# Altium schematic sheet P00160.5.28_P.SchDoc
size A2
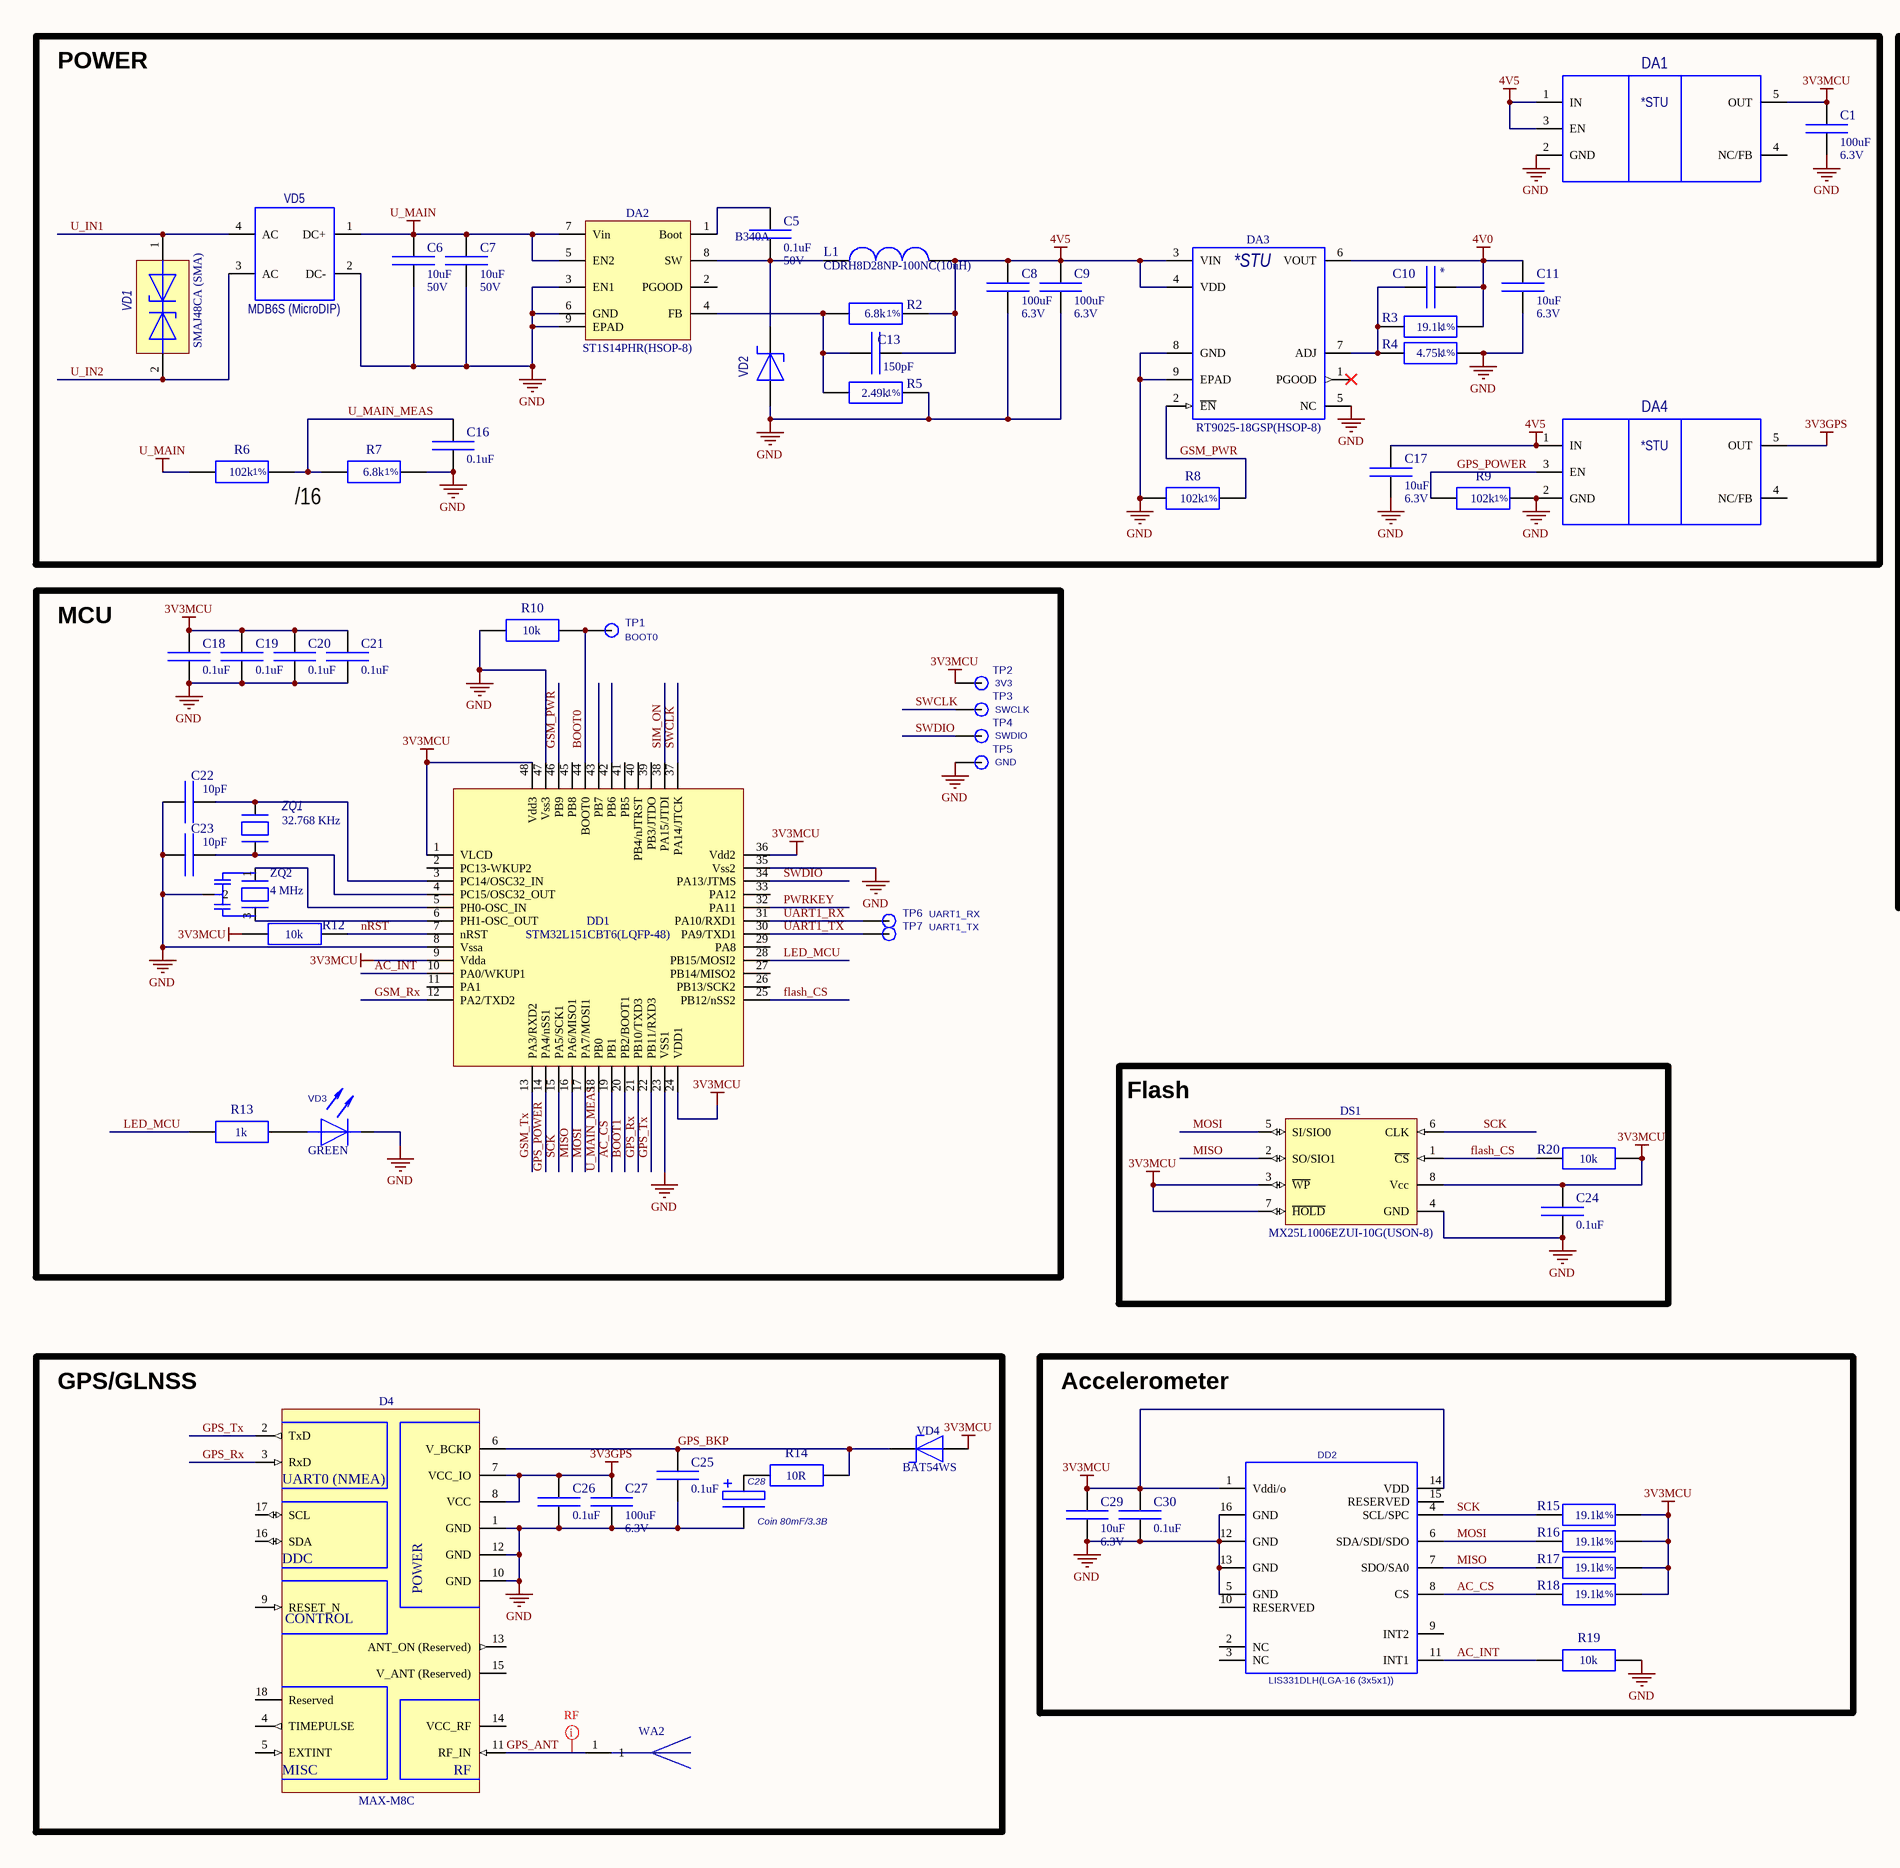
[diagram p0: P00160.5.28_P.SchDoc, left]
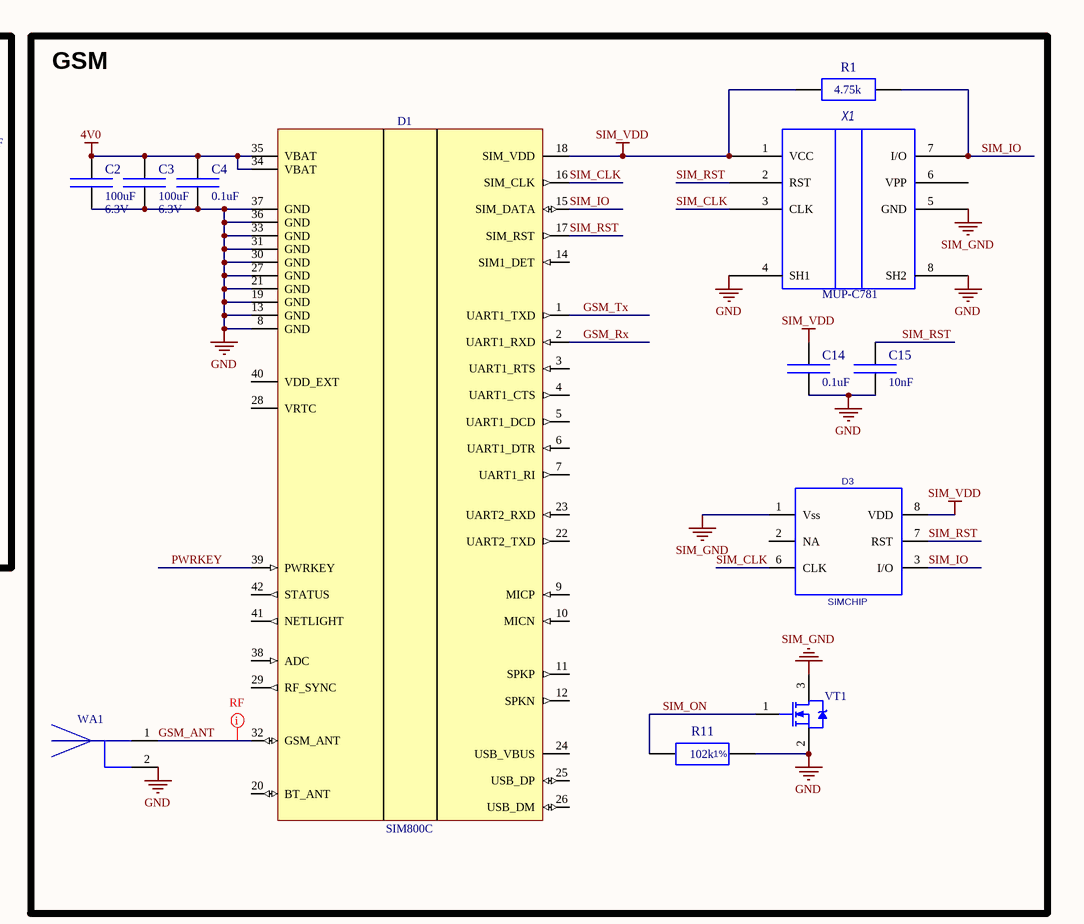
[diagram p1: P00160.5.28_P.SchDoc, right]

## Parts
C1  value 100uF  parVoltage: 6.3V  [CAPC3216X135(1206)]  (hidden comment: чип 1206 100uF/6.3V,)
C2  value 100uF  parVoltage: 6.3V  [CAPC3216X135(1206)]  (hidden comment: чип 1206 100uF/6.3V,)
C3  value 100uF  parVoltage: 6.3V  [CAPC3216X135(1206)]  (hidden comment: чип 1206 100uF/6.3V,)
C4  value 0.1uF  [CAPC1005X50(0402)]  (hidden comment: чип 0402 0.1uF/10V,)
C5  value 0.1uF  parVoltage: 50V  [CAPC1608X50(0603)]  (hidden comment: чип 0603 0.1uF/50V,)
C6  value 10uF  parVoltage: 50V  [CAPC3216X135(1206)]  (hidden comment: чип 1206 10uF/50V,)
C7  value 10uF  parVoltage: 50V  [CAPC3216X135(1206)]  (hidden comment: чип 1206 10uF/50V,)
C8  value 100uF  parVoltage: 6.3V  [CAPC3216X135(1206)]  (hidden comment: чип 1206 100uF/6.3V,)
C9  value 100uF  parVoltage: 6.3V  [CAPC3216X135(1206)]  (hidden comment: чип 1206 100uF/6.3V,)
C10  чип 0402 */,  [CAPC1005X50(0402)]  (value not drawn)
C11  value 10uF  parVoltage: 6.3V  [CAPC1608X50(0603)]  (hidden comment: чип 0603 10uF/6.3V,)
C13  value 150pF  [CAPC1005X50(0402)]  (hidden comment: чип 0402 150pF/50V,)
C14  value 0.1uF  [CAPC1005X50(0402)]  (hidden comment: чип 0402 0.1uF/10V,)
C15  value 10nF  [CAPC1005X50(0402)]  (hidden comment: чип 0402 10nF/10V,)
C16  value 0.1uF  [CAPC1005X50(0402)]  (hidden comment: чип 0402 0.1uF/10V,)
C17  value 10uF  parVoltage: 6.3V  [CAPC1608X50(0603)]  (hidden comment: чип 0603 10uF/6.3V,)
C18  value 0.1uF  [CAPC1005X50(0402)]  (hidden comment: чип 0402 0.1uF/10V,)
C19  value 0.1uF  [CAPC1005X50(0402)]  (hidden comment: чип 0402 0.1uF/10V,)
C20  value 0.1uF  [CAPC1005X50(0402)]  (hidden comment: чип 0402 0.1uF/10V,)
C21  value 0.1uF  [CAPC1005X50(0402)]  (hidden comment: чип 0402 0.1uF/10V,)
C22  value 10pF  [CAPC1005X50(0402)]  (hidden comment: чип 0402 10pF/10V,)
C23  value 10pF  [CAPC1005X50(0402)]  (hidden comment: чип 0402 10pF/10V,)
C24  value 0.1uF  [CAPC1005X50(0402)]  (hidden comment: чип 0402 0.1uF/10V,)
C25  value 0.1uF  [CAPC1005X50(0402)]  (hidden comment: чип 0402 0.1uF/10V,)
C26  value 0.1uF  [CAPC1005X50(0402)]  (hidden comment: чип 0402 0.1uF/10V,)
C27  value 100uF  parVoltage: 6.3V  [CAPC3216X135(1206)]  (hidden comment: чип 1206 100uF/6.3V,)
C28  Coin 80mF/3.3В  [XH414HG-IV01E]
C29  value 10uF  parVoltage: 6.3V  [CAPC1608X50(0603)]  (hidden comment: чип 0603 10uF/6.3V,)
C30  value 0.1uF  [CAPC1005X50(0402)]  (hidden comment: чип 0402 0.1uF/10V,)
D1  SIM800C  [SIMCOM800C]
D3  SIMCHIP  [VQFN127P600-8N]
D4  MAX-M8C  [MAX-7]
DA1  TPS76333DBV(SOT23-5)  [SOT95P285X130-5N(SOT23-5)]  (value not drawn)
DA2  ST1S14PHR(HSOP-8)  [HSOP127P-8N]
DA3  RT9025-18GSP(HSOP-8)  [HSOP127P-8N]
DA4  TPS76333DBV(SOT23-5)  [SOT95P285X130-5N(SOT23-5)]  (value not drawn)
DD1  STM32L151CBT6(LQFP-48)  [TSQFP50P900X900X160-48N]
DD2  LIS331DLH(LGA-16 (3x5x1))  [LGA16S50P3X5_300X300X100]
DS1  MX25L1006EZUI-10G(USON-8)  [SON50P300X60_HS-9N]
L1  CDRH8D28NP-100NC(10uH)  [CDRH8D28NP]
R1  value 4.75k  [RESC1005X35(0402)]  (hidden comment: чип 0402 4.75k 1%)
R2  value 6.8k  Tolerance: 1%  [RESC1005X35(0402)]  (hidden comment: чип 0402 6.8k 1%)
R3  value 19.1k  Tolerance: 1%  [RESC1005X35(0402)]  (hidden comment: чип 0402 19.1k 1%)
R4  value 4.75k  Tolerance: 1%  [RESC1005X35(0402)]  (hidden comment: чип 0402 4.75k 1%)
R5  value 2.49k  Tolerance: 1%  [RESC1005X35(0402)]  (hidden comment: чип 0402 2.49k 1%)
R6  value 102k  Tolerance: 1%  [RESC1005X35(0402)]  (hidden comment: чип 0402 102k 1%)
R7  value 6.8k  Tolerance: 1%  [RESC1005X35(0402)]  (hidden comment: чип 0402 6.8k 1%)
R8  value 102k  Tolerance: 1%  [RESC1005X35(0402)]  (hidden comment: чип 0402 102k 1%)
R9  value 102k  Tolerance: 1%  [RESC1005X35(0402)]  (hidden comment: чип 0402 102k 1%)
R10  value 10k  [RESC1005X35(0402)]  (hidden comment: чип 0402 10k 5%)
R11  value 102k  Tolerance: 1%  [RESC1005X35(0402)]  (hidden comment: чип 0402 102k 1%)
R12  value 10k  [RESC1005X35(0402)]  (hidden comment: чип 0402 10k 5%)
R13  value 1k  [RESC1005X35(0402)]  (hidden comment: чип 0402 1k 5%)
R14  value 10R  [RESC1005X35(0402)]  (hidden comment: чип 0402 10R 5%)
R15  value 19.1k  Tolerance: 1%  [RESC1005X35(0402)]  (hidden comment: чип 0402 19.1k 1%)
R16  value 19.1k  Tolerance: 1%  [RESC1005X35(0402)]  (hidden comment: чип 0402 19.1k 1%)
R17  value 19.1k  Tolerance: 1%  [RESC1005X35(0402)]  (hidden comment: чип 0402 19.1k 1%)
R18  value 19.1k  Tolerance: 1%  [RESC1005X35(0402)]  (hidden comment: чип 0402 19.1k 1%)
R19  value 10k  [RESC1005X35(0402)]  (hidden comment: чип 0402 10k 5%)
R20  value 10k  [RESC1005X35(0402)]  (hidden comment: чип 0402 10k 5%)
TP1  BOOT0  [TEST_POINT]  (no BOM)
TP2  3V3  [TEST_POINT]  (no BOM)
TP3  SWCLK  [TEST_POINT]  (no BOM)
TP4  SWDIO  [TEST_POINT]  (no BOM)
TP5  GND  [TEST_POINT]  (no BOM)
TP6  UART1_RX  [TEST_POINT]  (no BOM)
TP7  UART1_TX  [TEST_POINT]  (no BOM)
VD1  SMAJ48CA (SMA)  [DIOM5226X267N (SMA) B]
VD2  cmpPartNum: B340A  [DIOM5226X267N (SMA)]  (hidden comment: B340A (SMA))
VD3  parColor: GREEN  [LED1005X50N(0402)_GREEN]  (hidden comment: APHHS1005SURCK (чип 0402))
VD4  BAT54WS (SOD323)  [SOD2514X110N(SOD323)]  (value not drawn)
VD5  MDB6S (MicroDIP)  [Micro-DIP]
VT1  IRLML0030TRPBF (SOT-23)  [SOT95P230-3N (SOT-23) num]  (value not drawn)
WA1  (no value)  [PCB_ANT]
WA2  UDA182-180-1575-C-GPS-GLONASS-PCB  [UDA182]  (value not drawn)
X1  MUP Connectors MUP-C781  [MUP-C781]  (value not drawn)
ZQ1  value 32.768 KHz  [XTAL320X150X90-2N(DST)]  (hidden comment: DST310S(32.768 KHz))
ZQ2  value 4 MHz  [XTAL450X200X120 (CSTCR)]  (hidden comment: CSTCR4M00G15C99-R0(4 MHz))

## Blocks framed on the sheet
GSM: C2-C4 C14 C15 D1 D3 R1 R11 VT1 WA1 X1
MCU: C18-C23 DD1 R10 R12 R13 TP1-TP7 VD3 ZQ1 ZQ2
Flash: C24 DS1 R20
GPS/GLNSS: C25-C28 D4 R14 VD4 WA2
Accelerometer: C29 C30 DD2 R15-R19

## Nets
3V3GPS: C26.2(P2) C27.1 D4.7(VCC_IO) D4.8(VCC) DA4.5(OUT)
3V3MCU: C1.1 C18.2(P2) C19.2(P2) C20.2(P2) C21.2(P2) C24.2(P2) C29.2 C30.2(P2) DA1.5(OUT) DD1.1(VLCD) DD1.9(Vdda) DD1.24(VDD1) DD1.36(Vdd2) DD1.48(Vdd3) DD2.1(Vddi/o) DD2.14(VDD) DS1.3(~{WP}) DS1.7(~{HOLD}) DS1.8(Vcc) R12.1 R15.2 R16.2 R17.2 R18.2 R20.2 TP2.1 VD4.A
4V0: C2.1 C3.1 C4.2(P2) C10.1(P1) C11.2 D1.34(VBAT) D1.35(VBAT) DA3.6(VOUT) R3.2
4V5: C8.1 C9.1 C13.1(P1) C17.2 DA1.1(IN) DA1.3(EN) DA3.3(VIN) DA3.4(VDD) DA4.1(IN) L1.2 R2.2
GND: C1.2 C2.2 C3.2 C4.1(P1) C6.2 C7.2 C8.2 C9.2 C11.1 C14.1(P1) C15.1(P1) C16.1(P1) C17.1 C18.1(P1) C19.1(P1) C20.1(P1) C21.1(P1) C22.2(P2) C23.2(P2) C24.1(P1) C25.1(P1) C26.1(P1) C27.2 C28.2 C29.1 C30.1(P1) D1.8(GND) D1.13(GND) D1.19(GND) D1.21(GND) D1.27(GND) D1.30(GND) D1.31(GND) D1.33(GND) D1.36(GND) D1.37(GND) D4.1(GND) D4.10(GND) D4.12(GND) DA1.2(GND) DA2.3(EN1) DA2.6(GND) DA2.9(EPAD) DA3.5(NC) DA3.8(GND) DA3.9(EPAD) DA4.2(GND) DD1.8(Vssa) DD1.23(VSS1) DD1.35(Vss2) DD1.47(Vss3) DD2.5(GND) DD2.12(GND) DD2.13(GND) DD2.16(GND) DS1.4(GND) R4.2 R5.2 R7.2 R8.1 R9.2 R10.1 R11.2 R19.2 TP5.1 VD2.A VD3.C(cathode) VD5.2(DC-) VT1.2(S) WA1.2 X1.4(SH1) X1.8(SH2) ZQ2.2
SIM_GND: D3.1(Vss) VT1.3(D) X1.5(GND)
SIM_VDD: C14.2(P2) D1.18(SIM_VDD) D3.8(VDD) R1.1 X1.1(VCC)
U_MAIN: C6.1 C7.1 DA2.5(EN2) DA2.7(Vin) R6.1 VD5.1(DC+)
AC_CS: DD1.19(PB1) DD2.8(CS) R18.1
AC_INT: DD1.10(PA0/WKUP1) DD2.11(INT1) R19.1
BOOT0: DD1.44(BOOT0) R10.2 TP1.1
BOOT1: DD1.20(PB2/BOOT1)
flash_CS: DD1.25(PB12/nSS2) DS1.1(~{CS}) R20.1
GPS_ANT: D4.11(RF_IN) WA2.1
GPS_BKP: C25.2(P2) D4.6(V_BCKP) R14.2 VD4.C
GPS_POWER: DA4.3(EN) DD1.14(PA4/nSS1) R9.1
GPS_Rx: D4.3(RxD) DD1.21(PB10/TXD3)
GPS_Tx: D4.2(TxD) DD1.22(PB11/RXD3)
GSM_ANT: D1.32(GSM_ANT) WA1.1
GSM_PWR: DA3.2(~{EN}) DD1.46(PB9) R8.2
GSM_Rx: D1.2(UART1_RXD) DD1.12(PA2/TXD2)
GSM_Tx: D1.1(UART1_TXD) DD1.13(PA3/RXD2)
LED_MCU: DD1.28(PB15/MOSI2) R13.1
MISO: DD1.16(PA6/MISO1) DD2.7(SDO/SA0) DS1.2(SO/SIO1) R17.1
MOSI: DD1.17(PA7/MOSI1) DD2.6(SDA/SDI/SDO) DS1.5(SI/SIO0) R16.1
nRST: DD1.7(nRST) R12.2
PWRKEY: D1.39(PWRKEY) DD1.32(PA11)
SCK: DD1.15(PA5/SCK1) DD2.4(SCL/SPC) DS1.6(CLK) R15.1
SIM_CLK: D1.16(SIM_CLK) D3.6(CLK) X1.3(CLK)
SIM_IO: D1.15(SIM_DATA) D3.3(I/O) R1.2 X1.7(I/O)
SIM_ON: DD1.38(PA15/JTDI) R11.1 VT1.1(G)
SIM_RST: C15.2(P2) D1.17(SIM_RST) D3.7(RST) X1.2(RST)
SWCLK: DD1.37(PA14/JTCK) TP3.1
SWDIO: DD1.34(PA13/JTMS) TP4.1
U_IN1: VD1.1 VD5.4(AC)
U_IN2: VD1.2 VD5.3(AC)
U_MAIN_MEAS: C16.2(P2) DD1.18(PB0) R6.2 R7.1
UART1_RX: DD1.31(PA10/RXD1) TP6.1
UART1_TX: DD1.30(PA9/TXD1) TP7.1
NetC5_1: C5.1 DA2.8(SW) L1.1 VD2.C
NetC5_2: C5.2 DA2.1(Boot)
NetC10_2: C10.2(P2) DA3.7(ADJ) R3.1 R4.1
NetC13_2: C13.2(P2) DA2.4(FB) R2.1 R5.1
NetC22_1: C22.1(P1) DD1.3(PC14/OSC32_IN) ZQ1.1
NetC23_1: C23.1(P1) DD1.4(PC15/OSC32_OUT) ZQ1.2
NetC28_1: C28.1 R14.1
NetDD1_5: DD1.5(PH0-OSC_IN) ZQ2.1
NetDD1_6: DD1.6(PH1-OSC_OUT) ZQ2.3
NetR13_2: R13.2 VD3.A(anod)

Not connected (* = marked no-connect by the designer): D1 3(UART1_RTS) 4(UART1_CTS) 5(UART1_DCD) 6(UART1_DTR) 7(UART1_RI) 9(MICP) 10(MICN) 11(SPKP) 12(SPKN) 14(SIM1_DET) 20(BT_ANT) 22(UART2_TXD) 23(UART2_RXD) 24(USB_VBUS) 25(USB_DP) 26(USB_DM) 28(VRTC) 29(RF_SYNC) 38(ADC) 40(VDD_EXT) 41(NETLIGHT) 42(STATUS); D3 2(NA); D4 4(TIMEPULSE) 5(EXTINT) 9(RESET_N) 13(ANT_ON_(Reserved)) 14(VCC_RF) 15(V_ANT_(Reserved)) 16(SDA) 17(SCL) 18(Reserved); DA1 4(NC/FB); DA2 2(PGOOD); DA3 1(PGOOD)*; DA4 4(NC/FB); DD1 2(PC13-WKUP2) 11(PA1) 26(PB13/SCK2) 27(PB14/MISO2) 29(PA8) 33(PA12) 39(PB3/JTDO) 40(PB4/nJTRST) 41(PB5) 42(PB6) 43(PB7) 45(PB8) 49(TPAD); DD2 2(NC) 3(NC) 9(INT2) 10(RESERVED) 15(RESERVED); X1 6(VPP)

## Layout directives
net class RF: GPS_ANT, GSM_ANT

## Notes on the sheet
- POWER
- /16
- (in symbol MAX-7) UART0 (NMEA); DDC; POWER; CONTROL; MISC; RF
- (in symbol RT9025) *STU
- (in symbol TPS76333DBV) *STU

## Library data of the parts
C1-C3 C8 C9 C27 = C1206: cmpDescription: чип 1206 100uF *, 6.3V, ,; Tolerance: *; Category: Конденсатор; Примечание: *; cmpPkg: чип 1206
C4 C14 C16 C18-C21 C24-C26 C30 = C0402: cmpDescription: чип 0402 0.1uF , 10V, ,; parVoltage: 10V; Category: Конденсатор; cmpPkg: чип 0402
C5 = C0603: cmpDescription: чип 0603 0.1uF , 50V, ,; Category: Конденсатор; cmpPkg: чип 0603
C6 C7 = C1206: cmpPartNum: CL31A106KBHNNNE; cmpDescription: чип 1206 10uF *, 50V, , CL31A106KBHNNNE; Tolerance: *; Category: Конденсатор; Примечание: *; cmpPkg: чип 1206
C10 = C0402: cmpDescription: чип 0402 * , , ,; Category: Конденсатор; cmpPkg: чип 0402; Value: *
C11 C17 C29 = C0603: cmpDescription: чип 0603 10uF , 6.3V, ,; Category: Конденсатор; cmpPkg: чип 0603
C13 = C0402: cmpDescription: чип 0402 150pF , 50V, ,; parVoltage: 50V; Category: Конденсатор; cmpPkg: чип 0402
C15 = C0402: cmpDescription: чип 0402 10nF , 10V, ,; parVoltage: 10V; Category: Конденсатор; cmpPkg: чип 0402
C22 C23 = C0402: cmpDescription: чип 0402 10pF , 10V, ,; parVoltage: 10V; Category: Конденсатор; cmpPkg: чип 0402
C28 = XH414HG-IV01E: ELECTRIC DOUBLE LAYER CAPACITORS; cmpManufacturer: Seiko Instruments; Value: 80mF; cmpDescription: XH414HG-IV01E, Coin 80mF , 3.3В; parVoltage: 3.3В; parOTemp: –20°C to 60°C; parESR: 100 ом; Category: Конденсатор; cmpPartNum: XH414HG-IV01E; cmpPkg: Coin
D1 = SIM800C: cmpManufacturer: Simcom; cmpDescription: Разъем Simcom SIM800C; Category: Разъем; Value: SIM800C; cmpPartNum: SIM800C
D3 = SIMCHIP: cmpPartNum: MFF2 SIM; cmpManufacturer: МТС; cmpPkg: VQFN-8; cmpDescription: МТС MFF2 SIM (VQFN-8),; Value: *; Category: Микросхема
D4 = MAX-7: cmpManufacturer: Ublox; cmpDescription: Модуль GPS/GNSS Ublox MAX-M8C; cmpType: GPS/GNSS; Category: Модуль; cmpPartNum: MAX-M8C
DA1 DA4 = TPS76333DBV: cmpManufacturer: TI; parOTemp: -40°C to 125°C; cmpDescription: TI TPS76333DBV (SOT23-5), -40°C to 125°C; Category: Микросхема; cmpPartNum: TPS76333DBV; cmpPkg: SOT23-5
DA2 = ST1S14: cmpManufacturer: ST; cmpDescription: ST ST1S14PHR (HSOP-8), -40°C to +85°C; parOTemp: -40°C to +85°C; cmpCategory: Industrial; Category: Микросхема; cmpPartNum: ST1S14PHR; cmpPkg: HSOP-8
DA3 = RT9025: 2A, Ultra Low Dropout LDO; cmpManufacturer: Richtek; parOTemp: -40°C to 85°C; cmpDescription: Richtek RT9025-18GSP (HSOP-8), -40°C to 85°C; cmpPartNum: RT9025-18GSP; cmpPkg: HSOP-8; Category: Микросхема
DD1 = STM32L151CxU6: cmpManufacturer: ST; cmpDescription: ST STM32L151CBT6 (LQFP-48), -40°C to +85°C; parOTemp: -40°C to +85°C; cmpCategory: Industrial; Category: Микросхема; cmpPartNum: STM32L151CBT6; cmpPkg: LQFP-48
DD2 = LIS331DLH: MEMS digital output motion sensor  ultra low-power high performance 3-axes “nano” accelerometer; cmpManufacturer: ST; cmpDescription: ST LIS331DLH (LGA-16 (3x5x1)), -40°C to +85°C; parOTemp: -40°C to +85°C; cmpCategory: Industrial; Value: *; Примечание: *; Category: Микросхема; cmpPartNum: LIS331DLH; cmpPkg: LGA-16 (3x5x1)
DS1 = MX25L1006E: 1M-BIT [x 1/x 2] CMOS SERIAL FLASH; cmpManufacturer: Macronix; cmpDescription: Macronix MX25L1006EZUI-10G (USON-8), -40°C to 85°C; parOTemp: -40°C to 85°C; Category: Микросхема; Примечание: *; cmpPartNum: MX25L1006EZUI-10G; cmpPkg: USON-8
L1 = CDRH8D28NP: cmpManufacturer: Sumida; cmpDescription: CDRH8D28NP-100NC, 10uH ,; Category: Дроссель; cmpPartNum: CDRH8D28NP-100NC; cmpPkg: CDRH8D28NP; Value: 10uH
R1 R4 = R0402: cmpDescription: чип 0402 4.75k 1%, 62 мВт, ,; parPwr: 62 мВт; Category: Резистор; cmpPkg: чип 0402
  R1: Tolerance: 1%
R2 R7 = R0402: cmpDescription: чип 0402 6.8k 1%, 62 мВт, ,; parPwr: 62 мВт; Category: Резистор; cmpPkg: чип 0402
R3 R15-R18 = R0402: cmpDescription: чип 0402 19.1k 1%, 62 мВт, ,; parPwr: 62 мВт; Category: Резистор; cmpPkg: чип 0402
R5 = R0402: cmpDescription: чип 0402 2.49k 1%, 62 мВт, ,; parPwr: 62 мВт; Category: Резистор; cmpPkg: чип 0402
R6 R8 R9 R11 = R0402: cmpDescription: чип 0402 102k 1%, 62 мВт, ,; parPwr: 62 мВт; Category: Резистор; cmpPkg: чип 0402
R10 R12 R19 R20 = R0402: cmpDescription: чип 0402 10k 5%, 62 мВт, ,; parPwr: 62 мВт; Category: Резистор; cmpPkg: чип 0402; Tolerance: 5%
R13 = R0402: cmpDescription: чип 0402 1k 5%, 62 мВт, ,; parPwr: 62 мВт; Category: Резистор; cmpPkg: чип 0402; Tolerance: 5%
R14 = R0402: cmpDescription: чип 0402 10R 5%, 62 мВт, ,; parPwr: 62 мВт; Category: Резистор; cmpPkg: чип 0402; Tolerance: 5%
TP1-TP7 = TEST_POINT: cmpCategory: Industrial; Category: Тестпойнт
  TP1: Value: BOOT0
  TP2: Value: 3V3
  TP3: Value: SWCLK
  TP4: Value: SWDIO
  TP5: Value: GND
  TP6: Value: UART1_RX
  TP7: Value: UART1_TX
VD1 = SMA Zener (Bidir): Zener (TVS) Diode in SMA package Bidirectional; parZCurrent: 5.2А; parPwr: 400Вт; parVoltage: 48В; cmpDescription: SMAJ48CA, Zener, 48В, SMA, Bidirectional; Category: Диод; Примечание: *; cmpPkg: SMA; cmpPartNum: SMAJ48CA; cmpType: Zener; cmpDirection: Bidirectional
VD2 = SMA SCHOTTKY: Schottky diode in SMA Case; cmpManufacturer: Vishay; parIf: 1А; parPd: хххмВт; parVdc: 60В; cmpDescription: B340A, Schottky 1А 60В, SMA; parOTemp: -65°C to +150°C; parIpk: 40А; parIr: 0.2мА; parVf: 0.75В; Category: Диод; cmpPkg: SMA; cmpType: Schottky
VD3 = LED 0402: cmpManufacturer: Kingbright; parFCurrent: 20мА; cmpMaterial: AlGaInP; parPwr: 75мВт; parVoltage: 5; cmpDescription: APHHS1005SURCK, LED GREEN, 20мА 70мкд, 5, чип 0402; parLvTyp: 70мкд; Примечание: *; Category: Диод; cmpPkg: чип 0402; cmpPartNum: APHHS1005SURCK; cmpType: LED
VD4 = BAT54WS: parFCurrent: xxxА; parPwr: хххмВт; parVoltage: хххВ; cmpType: Schottky; cmpDescription: BAT54WS, Schottky, xxxА, хххВ, SOD323; Примечание: *; Category: Диод; cmpPkg: SOD323; cmpPartNum: BAT54WS
VD5 = MDB6S: B1S-B10S 0.5 surface mount glass passivated bridge rectifier; cmpManufacturer: Fairchild; cmpDescription: MDB6S, BRIDGE RECTIFIER, MicroDIP; parOTemp: -55°C to 150°C; parCap: 10pF; parIf: 1А; parVdc: 600В; Category: Диод; cmpPkg: MicroDIP; cmpPartNum: MDB6S; cmpType: BRIDGE RECTIFIER
VT1 = IRLML0030: HEXFET Power MOSFET; cmpManufacturer: IR; parOTemp: -55°C to 150°C; parCurrent: 5.3А; parRds: 40мОм; parVgs: ±20В; cmpType: N-Channel mosfet; parVds: 30В; cmpDescription: IRLML0030TRPBF, N-Channel mosfet, Vds=30В, Vgs=±20В, 5.3А, 40мОм, SOT-23; cmpPkg: SOT-23; cmpPartNum: IRLML0030TRPBF; category: Транзистор
WA1 = ANT_PCB_CLIP: CLIP_ANT; cmpDescription: Антенна  , , ,; Category: Антенна; Примечание: *
WA2 = GPS antenna Pass: A25, UDA25, A18; cmpManufacturer: AMOTECH; cmpDescription: Антенна AMOTECH UDA182-180-1575-C-GPS-GLONASS-PCB, 1575~1608МГц, 50 Ом, 3.5dBi; parGain: 3.5dBi; parZ: 50 Ом; parFreq: 1575~1608МГц; Category: Антенна; Примечание: *; cmpPartNum: UDA182-180-1575-C-GPS-GLONASS-PCB
X1 = SIM MUP-C781: Sim Holder MUP-C781; cmpDescription: MUP Connectors MUP-C781, Nano SIM CARD Connector; cmpType: Nano SIM CARD Connector; Value: *; Category: Разъем; cmpPartNum: MUP-C781; cmpManufacturer: MUP Connectors
ZQ1 = XTAL, SMD, 3.2mm x 1.5mm, 2 pads: DST310S; cmpManufacturer: Daishinku Corporation; cmpPkg: SMD, 3.2x1.5 mm; parOTemp: -40°C to 85°C; cmpDescription: Кварцевый Резонатор Daishinku Corporation DST310S, (32.768 KHz), 9pF, SMD, 3.2x1.5 mm,  pads, -40°C to 85°C; parCload: 9pF; Category: Кварцевый Резонатор; cmpPartNum: DST310S
ZQ2 = XTAL, SMD, 4.5mm x 2mm, 3 pads: CSTCR_G15C Ceramic Resonators; cmpManufacturer: Murata; cmpPkg: SMD, 4.5x2.0 mm; Tolerance: ±0.5%; parCload: BuiltIN cap; cmpDescription: Murata CSTCR4M00G15C99-R0, (4 MHz±0.5%), BuiltIN cap, -40°C to 125°C; parOTemp: -40°C to 125°C; Category: Кварцевый Резонатор; cmpPartNum: CSTCR4M00G15C99-R0